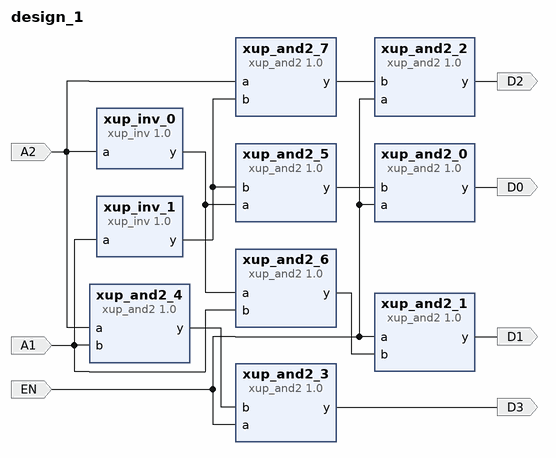
[diagram p0: block diagram of the top level]
# Vivado block design design_1, xc7vx485tffg1157-1, Vivado 2019.2
create_bd_design design_1

create_bd_port -dir I EN
create_bd_port -dir I A2
create_bd_port -dir I A1
create_bd_port -dir O D0
create_bd_port -dir O D1
create_bd_port -dir O D2
create_bd_port -dir O D3

create_bd_cell -type ip -vlnv xilinx.com:XUP:xup_inv:1.0 xup_inv_0
create_bd_cell -type ip -vlnv xilinx.com:XUP:xup_inv:1.0 xup_inv_1
create_bd_cell -type ip -vlnv xilinx.com:XUP:xup_and2:1.0 xup_and2_0
create_bd_cell -type ip -vlnv xilinx.com:XUP:xup_and2:1.0 xup_and2_1
create_bd_cell -type ip -vlnv xilinx.com:XUP:xup_and2:1.0 xup_and2_2
create_bd_cell -type ip -vlnv xilinx.com:XUP:xup_and2:1.0 xup_and2_3
create_bd_cell -type ip -vlnv xilinx.com:XUP:xup_and2:1.0 xup_and2_4
create_bd_cell -type ip -vlnv xilinx.com:XUP:xup_and2:1.0 xup_and2_5
create_bd_cell -type ip -vlnv xilinx.com:XUP:xup_and2:1.0 xup_and2_6
create_bd_cell -type ip -vlnv xilinx.com:XUP:xup_and2:1.0 xup_and2_7

# ---- connections ----

connect_bd_net [get_bd_ports EN] [get_bd_pins xup_and2_0/a] [get_bd_pins xup_and2_1/a] [get_bd_pins xup_and2_2/a] [get_bd_pins xup_and2_3/a]
connect_bd_net -net A2_1 [get_bd_ports A2] [get_bd_pins xup_inv_0/a] [get_bd_pins xup_and2_7/a] [get_bd_pins xup_and2_4/a]
connect_bd_net -net A1_1 [get_bd_ports A1] [get_bd_pins xup_inv_1/a] [get_bd_pins xup_and2_6/b] [get_bd_pins xup_and2_4/b]
connect_bd_net [get_bd_pins xup_inv_0/y] [get_bd_pins xup_and2_5/a] [get_bd_pins xup_and2_6/a]
connect_bd_net [get_bd_pins xup_and2_5/y] [get_bd_pins xup_and2_0/b]
connect_bd_net [get_bd_pins xup_and2_6/y] [get_bd_pins xup_and2_1/b]
connect_bd_net [get_bd_pins xup_and2_7/y] [get_bd_pins xup_and2_2/b]
connect_bd_net [get_bd_pins xup_and2_4/y] [get_bd_pins xup_and2_3/b]
connect_bd_net [get_bd_pins xup_inv_1/y] [get_bd_pins xup_and2_5/b] [get_bd_pins xup_and2_7/b]
connect_bd_net [get_bd_pins xup_and2_0/y] [get_bd_ports D0]
connect_bd_net [get_bd_pins xup_and2_1/y] [get_bd_ports D1]
connect_bd_net [get_bd_pins xup_and2_2/y] [get_bd_ports D2]
connect_bd_net [get_bd_pins xup_and2_3/y] [get_bd_ports D3]

validate_bd_design
save_bd_design
